# Altium project Service_eval_board.PrjPcb (part 1 of 3)
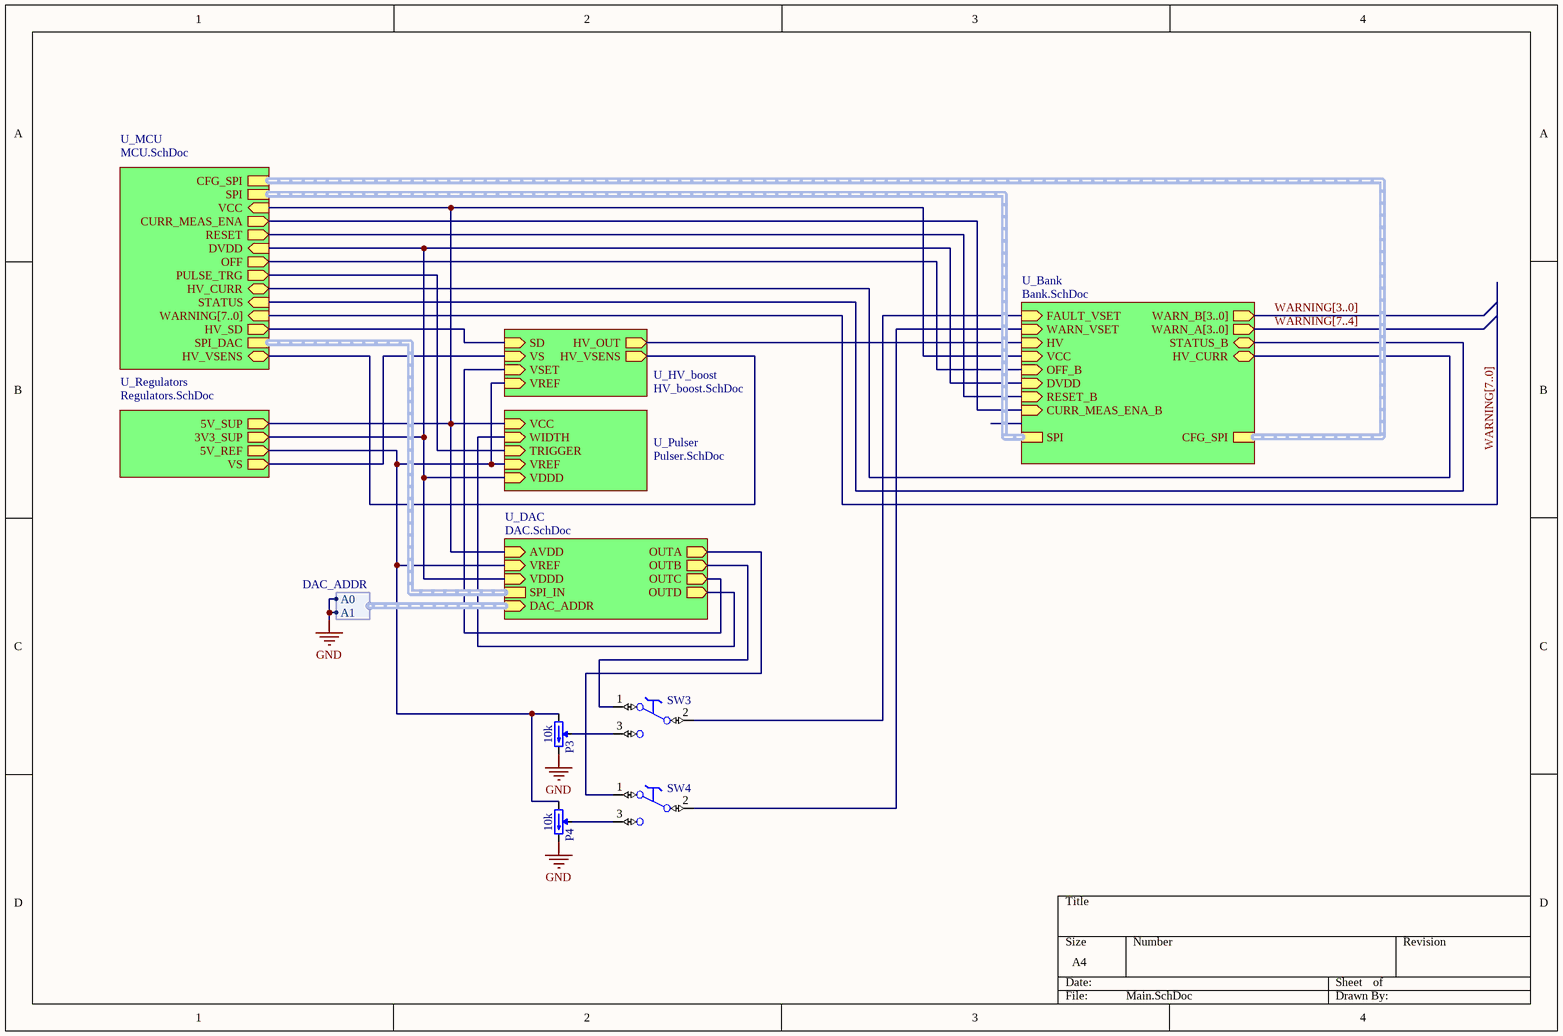
[diagram p0: Main.SchDoc]
10 sheets, 592 parts. Net scope: hierarchical (ports join the sheet entries above them; power ports are global).
Board file: PCB.PcbDoc
Sheets:
  Main.SchDoc
    U_Pulser = Pulser.SchDoc
    U_HV_boost = HV_boost.SchDoc
    U_MCU = MCU.SchDoc
    U_Bank = Bank.SchDoc
      U_Channel = Channel.SchDoc
        U_Switch = Switch.SchDoc
        U_Switch = Switch.SchDoc
        U_TRD = TRD.SchDoc
        U_TRD = TRD.SchDoc
      U_Channel = Channel.SchDoc
        U_Switch = Switch.SchDoc
        U_Switch = Switch.SchDoc
        U_TRD = TRD.SchDoc
        U_TRD = TRD.SchDoc
      U_Channel = Channel.SchDoc
        U_Switch = Switch.SchDoc
        U_Switch = Switch.SchDoc
        U_TRD = TRD.SchDoc
        U_TRD = TRD.SchDoc
      U_Channel = Channel.SchDoc
        U_Switch = Switch.SchDoc
        U_Switch = Switch.SchDoc
        U_TRD = TRD.SchDoc
        U_TRD = TRD.SchDoc
    U_DAC = DAC.SchDoc
    U_Regulators = Regulators.SchDoc

## Sheet Main.SchDoc
size A4; DocumentNumber: 1; SheetNumber: 1; SheetTotal: 10

### Parts
P3  10k  [TRIM_BOURNS_3266W]
P4  10k  [TRIM_BOURNS_3266W]
SW3  Switch  [SW_TYCO_1-1437575-4]  (value not drawn)
SW4  Switch  [SW_TYCO_1-1437575-4]  (value not drawn)

### Sub-sheets
U_Bank = Bank.SchDoc: FAULT_VSET (in), WARN_VSET (in), HV (in), VCC (in), OFF_B (in), DVDD (in), RESET_B (in), CURR_MEAS_ENA_B (in), SPI (harness SPI), CFG_SPI (harness CFG_SPI), WARN_B[3..0] (out), WARN_A[3..0] (out), STATUS_B (bidir), HV_CURR (bidir)
U_DAC = DAC.SchDoc: AVDD (in), VREF (in), VDDD (in), SPI_IN (harness SPI_DAC), DAC_ADDR (in, harness DAC_ADDR), OUTA (out), OUTB (out), OUTC (out), OUTD (out)
U_HV_boost = HV_boost.SchDoc: VS (in), HV_OUT (out), SD (in), VSET (in), VREF (in), HV_VSENS (out)
U_MCU = MCU.SchDoc: STATUS (in), OFF (out), RESET (out), CURR_MEAS_ENA (out), SPI (harness SPI), CFG_SPI (harness CFG_SPI), WARNING[7..0] (in), DVDD (in), VCC (in), HV_CURR (bidir), PULSE_TRG (out), HV_SD (out), SPI_DAC (harness SPI_DAC), HV_VSENS (bidir)
U_Pulser = Pulser.SchDoc: VCC (in), WIDTH (in), TRIGGER (in), VREF (in), VDDD (in)
U_Regulators = Regulators.SchDoc: 5V_SUP (out), 3V3_SUP (out), 5V_REF (out), VS (out)

### Harnesses
DAC_ADDR: A0, A1

### Nets
DVDD: sheet U_Pulser/VDDD, sheet U_MCU/DVDD, sheet U_Bank/DVDD, sheet U_DAC/VDDD, sheet U_Regulators/3V3_SUP
GND: P3.3(CW) P4.3(CW) ; sheet U_DAC/DAC_ADDR.A0, sheet U_DAC/DAC_ADDR.A1
OUTA: SW4.1(NC) ; sheet U_DAC/OUTA
OUTB: SW3.1(NC) ; sheet U_DAC/OUTB
OUTC: sheet U_HV_boost/VSET, sheet U_DAC/OUTC
OUTD: sheet U_Pulser/WIDTH, sheet U_DAC/OUTD
NetC2_1: sheet U_HV_boost/VS, sheet U_Regulators/VS
NetC15_2: sheet U_HV_boost/HV_OUT, sheet U_Bank/HV
NetC45_1_1: sheet U_Pulser/VCC, sheet U_MCU/VCC, sheet U_Bank/VCC, sheet U_DAC/AVDD, sheet U_Regulators/5V_SUP
NetD12_1: sheet U_HV_boost/HV_VSENS, sheet U_MCU/HV_VSENS
NetIC2_1_2: sheet U_MCU/OFF, sheet U_Bank/OFF_B
NetIC2_1_4: sheet U_MCU/RESET, sheet U_Bank/RESET_B
NetIC2_1_6: sheet U_MCU/CURR_MEAS_ENA, sheet U_Bank/CURR_MEAS_ENA_B
NetIC6_23: sheet U_MCU/HV_CURR, sheet U_Bank/HV_CURR
NetIC6_56: sheet U_MCU/STATUS, sheet U_Bank/STATUS_B
NetIC6_61: sheet U_HV_boost/SD, sheet U_MCU/HV_SD
NetIC6_62: sheet U_Pulser/TRIGGER, sheet U_MCU/PULSE_TRG
NetL7_2: P3.1(CCW) P4.1(CCW) ; sheet U_Pulser/VREF, sheet U_HV_boost/VREF, sheet U_DAC/VREF, sheet U_Regulators/5V_REF
NetP3_2: P3.2(W) SW3.3(NO)
NetP4_2: P4.2(W) SW4.3(NO)
NetR40_1_1: SW3.2(C) ; sheet U_Bank/FAULT_VSET
NetR41_1_1: SW4.2(C) ; sheet U_Bank/WARN_VSET

### Buses and harness runs
bus WARNING[3..0] = sheet U_Bank/WARN_B[3..0]
bus WARNING[7..0] = sheet U_MCU/WARNING[7..0]
bus WARNING[7..4] = sheet U_Bank/WARN_A[3..0]
harness sheet U_Bank/CFG_SPI = sheet U_MCU/CFG_SPI
harness sheet U_Bank/SPI = sheet U_MCU/SPI
harness sheet U_DAC/SPI_IN = sheet U_MCU/SPI_DAC

### Library data of the parts
P3 P4 = TRIM_12T_10K_BOURNS_3266W-1-103LF: Trimming Potentiometer; Part Description: 12 Turn Trimming Potentiometer (Top Adjustement); Manufacturer: BOURNS; Power: 0.25W; TC: ±100ppm/°C; Tolerance: ±10%; PressFit: No; Part Number: TRIM_12T_10K_BOURNS_3266W-1-103LF; Component Kind: Standard; Component Type: Standard; Pin Count: 3; Value: 10k; Manufacturer Part Number: 3266W-1-103LF; Case: 3266W; Mounted: Yes; Socket: No; SMD: No; Sense: No; ComponentHeight: 7.75mm; HelpURL: \\cern.ch\dfs\Applications\Altium\Datasheets\TRIM_BOURNS_3266W.pdf; Author: CERN DEM JLC; CreateDate: 10.06.2008; LatestRevisionDate: 28.11.2012
SW3 SW4 = SW_TYCO_1-1437575-4: SPDT Switch; Part Description: 30VDC, 100mA, Slide Low Profile SPDT Switch, SSA Series; Manufacturer: TYCO; Manufacturer Part Number: 1-1437575-4 or SSA-12; PressFit: No; Part Number: SW_TYCO_1-1437575-4; Component Kind: Standard; Component Type: Standard; Pin Count: 3; PackageDescription: Body 8.79 x 3.4mm, Slide Low Profile SPDT Switch, SSA Series; Family: Switch; Mounted: Yes; Socket: No; SMD: No; Sense: No; Status: None; ComponentHeight: 5.4mm; HelpURL: \\cern.ch\dfs\Applications\Altium\Datasheets\SW_TYCO_1-1437575-4.pdf; Author: CERN DEM JLC; CreateDate: 11.11.2013; LatestRevisionDate: 11.11.2013

## Sheet Pulser.SchDoc
size A3; DocumentNumber: 6; SheetNumber: 6; SheetTotal: 10
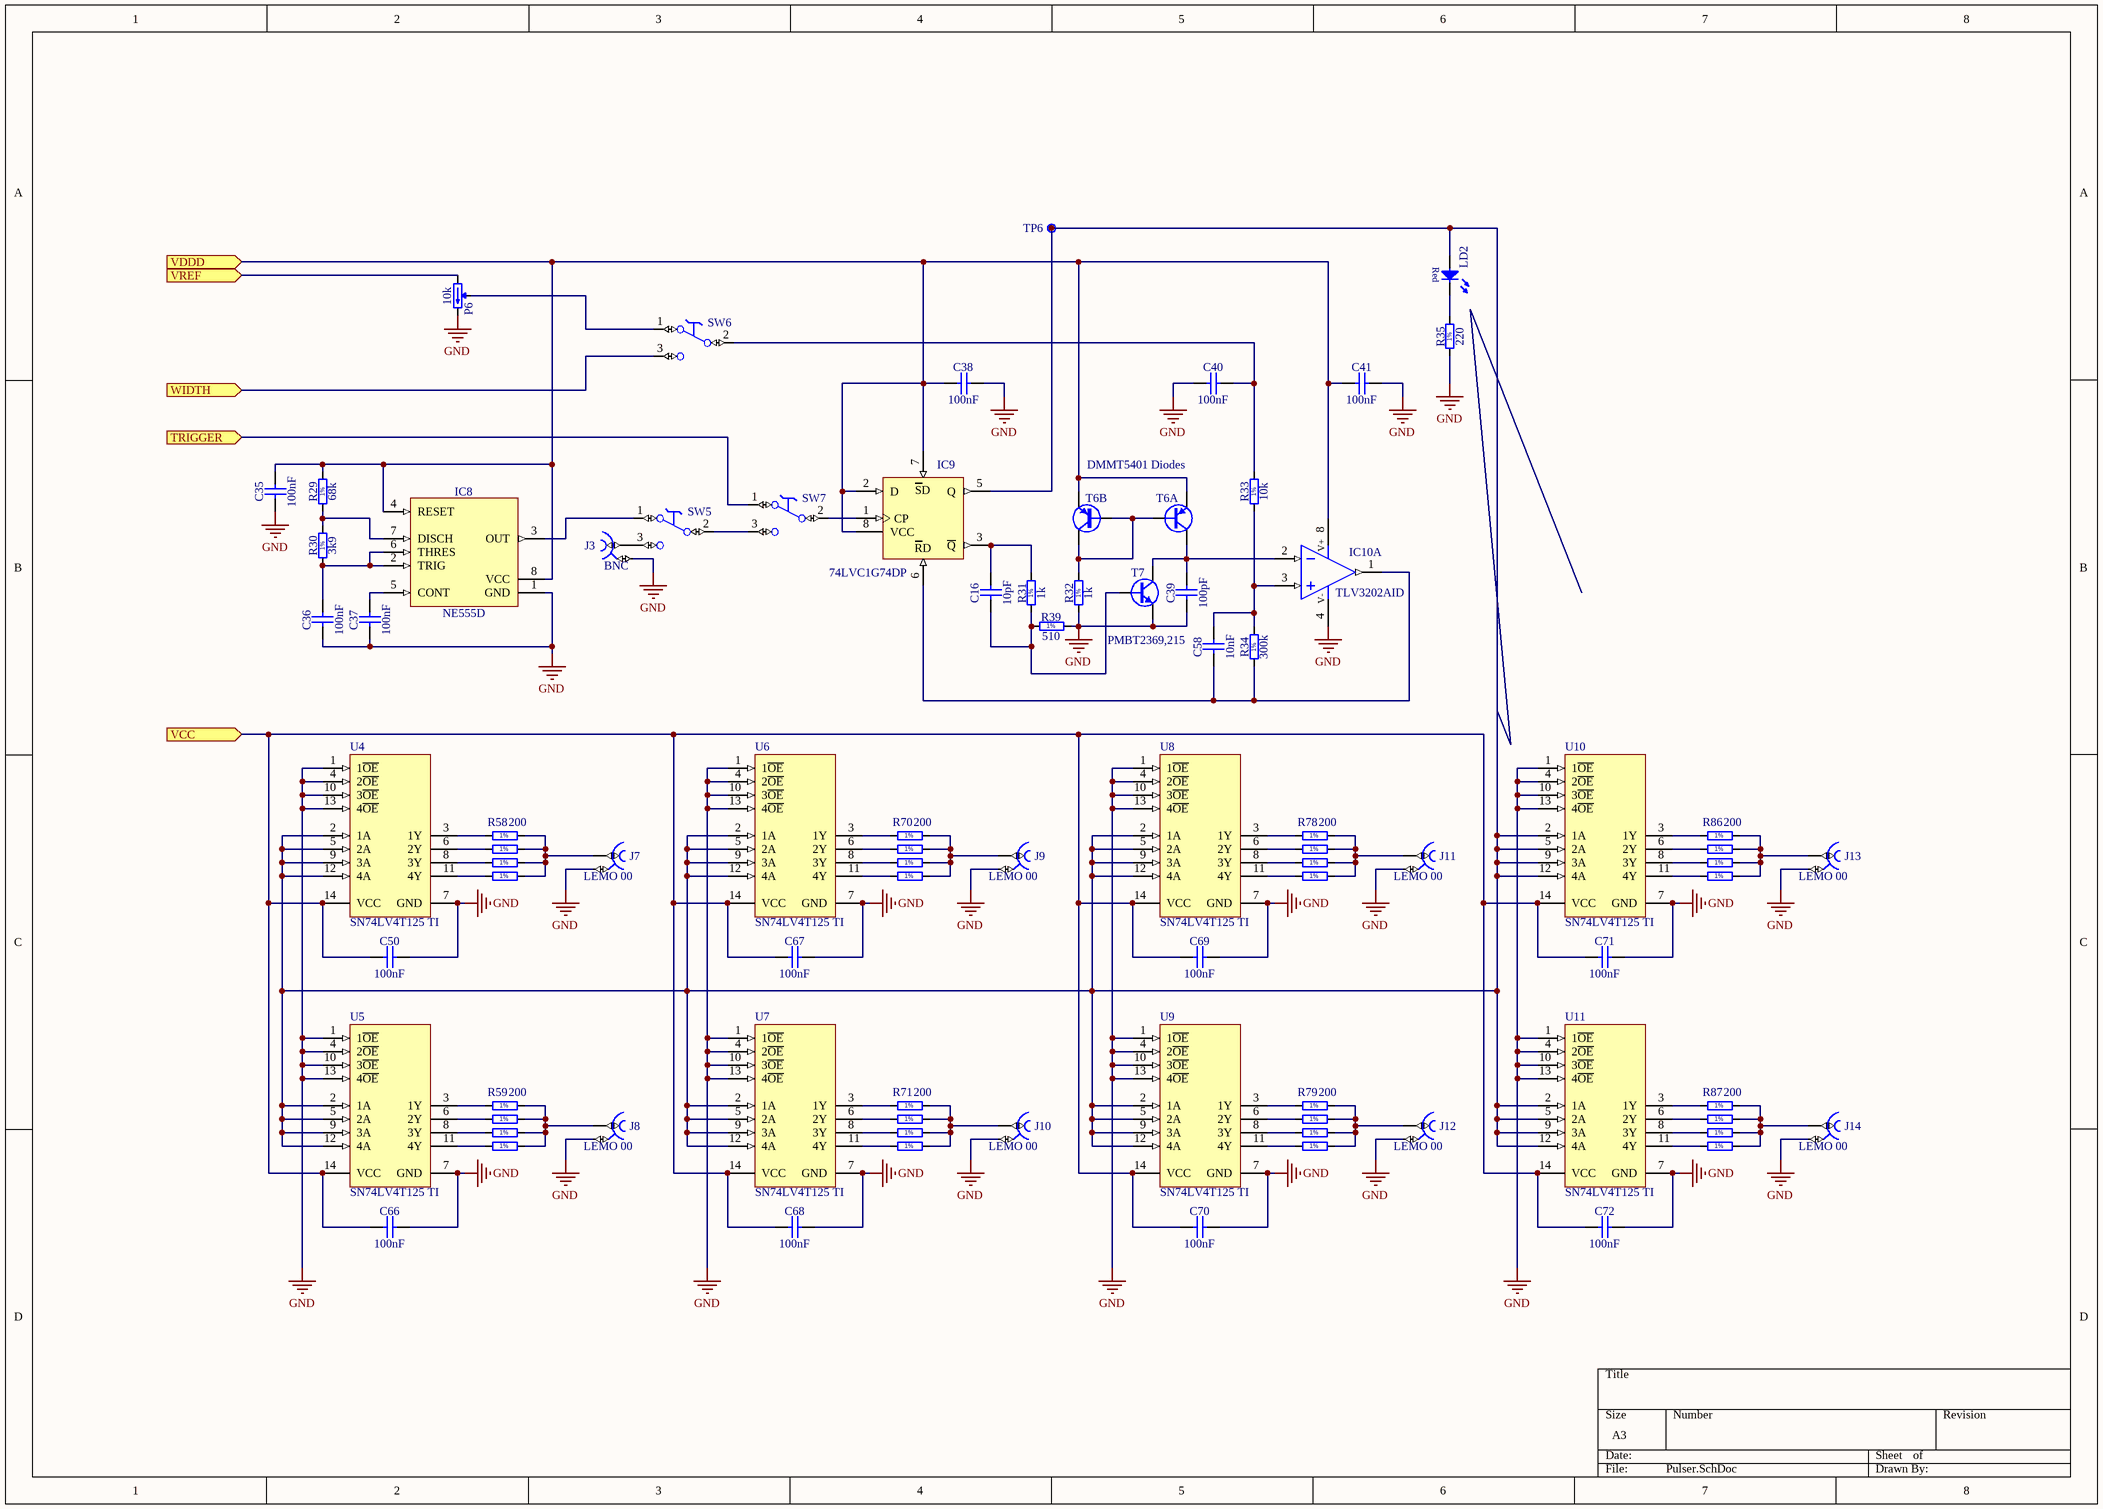
[diagram p1: Pulser.SchDoc]

### Parts
C16  10pF  [CAPC2012X135N]
C35  100nF  [CAPC2012X135N]
C36  100nF  [CAPC2012X135N]
C37  100nF  [CAPC2012X135N]
C38  100nF  [CAPC2012X135N]
C39  100pF  [CAPC2012X88N]
C40  100nF  [CAPC2012X135N]
C41  100nF  [CAPC2012X135N]
C50  100nF  [CAPC2012X135N]
C58  10nF  [CAPC2012X135N]
C66  100nF  [CAPC2012X135N]
C67  100nF  [CAPC2012X135N]
C68  100nF  [CAPC2012X135N]
C69  100nF  [CAPC2012X135N]
C70  100nF  [CAPC2012X135N]
C71  100nF  [CAPC2012X135N]
C72  100nF  [CAPC2012X135N]
IC8  NE555D  [SOIC127P600X175-8N]
IC9  74LVC1G74DP  [SOP65P400X110-8N]
IC10  TLV3202AID  [SOIC127P600X175-8N]  (part A of 2)
J3  BNC  [AMPHENOL_31-5329]
J7  LEMO 00  [LEMO_EPK.00.250.NTN]
J8  LEMO 00  [LEMO_EPK.00.250.NTN]
J9  LEMO 00  [LEMO_EPK.00.250.NTN]
J10  LEMO 00  [LEMO_EPK.00.250.NTN]
J11  LEMO 00  [LEMO_EPK.00.250.NTN]
J12  LEMO 00  [LEMO_EPK.00.250.NTN]
J13  LEMO 00  [LEMO_EPK.00.250.NTN]
J14  LEMO 00  [LEMO_EPK.00.250.NTN]
LD2  Super Red  [LED_OSRAM_LSR976]  (value not drawn)
P6  10k  [TRIM_BOURNS_3266W]
R29  68k  [RESC2012X60N]
R30  3k9  [RESC2012X60N]
R31  1k  [RESC2012X60N]
R32  1k  [RESC2012X60N]
R33  10k  [RESC2012X60N]
R34  300k  [RESC2012X60N]
R35  220  [RESC2012X60N]
R39  510  [RESC2012X60N]
R58  200  [RESC2012X60N]
R59  200  [RESC2012X60N]
R60  200  [RESC2012X60N]  (value not drawn)
R61  200  [RESC2012X60N]  (value not drawn)
R62  200  [RESC2012X60N]  (value not drawn)
R63  200  [RESC2012X60N]  (value not drawn)
R64  200  [RESC2012X60N]  (value not drawn)
R65  200  [RESC2012X60N]  (value not drawn)
R70  200  [RESC2012X60N]
R71  200  [RESC2012X60N]
R72  200  [RESC2012X60N]  (value not drawn)
R73  200  [RESC2012X60N]  (value not drawn)
R74  200  [RESC2012X60N]  (value not drawn)
R75  200  [RESC2012X60N]  (value not drawn)
R76  200  [RESC2012X60N]  (value not drawn)
R77  200  [RESC2012X60N]  (value not drawn)
R78  200  [RESC2012X60N]
R79  200  [RESC2012X60N]
R80  200  [RESC2012X60N]  (value not drawn)
R81  200  [RESC2012X60N]  (value not drawn)
R82  200  [RESC2012X60N]  (value not drawn)
R83  200  [RESC2012X60N]  (value not drawn)
R84  200  [RESC2012X60N]  (value not drawn)
R85  200  [RESC2012X60N]  (value not drawn)
R86  200  [RESC2012X60N]
R87  200  [RESC2012X60N]
R88  200  [RESC2012X60N]  (value not drawn)
R89  200  [RESC2012X60N]  (value not drawn)
R90  200  [RESC2012X60N]  (value not drawn)
R91  200  [RESC2012X60N]  (value not drawn)
R92  200  [RESC2012X60N]  (value not drawn)
R93  200  [RESC2012X60N]  (value not drawn)
SW5  Switch  [SW_TYCO_1-1437575-4]  (value not drawn)
SW6  Switch  [SW_TYCO_1-1437575-4]  (value not drawn)
SW7  Switch  [SW_TYCO_1-1437575-4]  (value not drawn)
T6  DMMT5401 Diodes  [SOT95P280X145-6N]  (parts A,B of 2)
T7  PMBT2369,215  [SOT95P230X110-3N]
TP6  Test Point  [VERO_20-2136]  (value not drawn)
U4  SN74LV4T125 TI  [SOP65P640X110-14N]
U5  SN74LV4T125 TI  [SOP65P640X110-14N]
U6  SN74LV4T125 TI  [SOP65P640X110-14N]
U7  SN74LV4T125 TI  [SOP65P640X110-14N]
U8  SN74LV4T125 TI  [SOP65P640X110-14N]
U9  SN74LV4T125 TI  [SOP65P640X110-14N]
U10  SN74LV4T125 TI  [SOP65P640X110-14N]
U11  SN74LV4T125 TI  [SOP65P640X110-14N]

### Ports
TRIGGER (in), VCC (in), VDDD (in), VREF (in), WIDTH (in)

### Nets
DVDD: C35.2 C38.1 C41.1 IC8.4(RESET) IC8.8(VCC) IC9.2(D) IC9.7(~{S}D) IC9.8(VCC) IC10.8(V+) R29.2 T6.5(E) T6.6(E) ; port VDDD
GND: C35.1 C36.1 C37.1 C38.2 C39.1 C40.1 C41.2 C50.2 C66.2 C67.2 C68.2 C69.2 C70.2 C71.2 C72.2 IC8.1(GND) IC10.4(V-) J3.2 J7.2 J8.2 J9.2 J10.2 J11.2 J12.2 J13.2 J14.2 P6.3(CW) R32.1 R35.1 R39.2 T7.2(E) U4.1(1~{OE}) U4.4(2~{OE}) U4.7(GND) U4.10(3~{OE}) U4.13(4~{OE}) U5.1(1~{OE}) U5.4(2~{OE}) U5.7(GND) U5.10(3~{OE}) U5.13(4~{OE}) U6.1(1~{OE}) U6.4(2~{OE}) U6.7(GND) U6.10(3~{OE}) U6.13(4~{OE}) U7.1(1~{OE}) U7.4(2~{OE}) U7.7(GND) U7.10(3~{OE}) U7.13(4~{OE}) U8.1(1~{OE}) U8.4(2~{OE}) U8.7(GND) U8.10(3~{OE}) U8.13(4~{OE}) U9.1(1~{OE}) U9.4(2~{OE}) U9.7(GND) U9.10(3~{OE}) U9.13(4~{OE}) U10.1(1~{OE}) U10.4(2~{OE}) U10.7(GND) U10.10(3~{OE}) U10.13(4~{OE}) U11.1(1~{OE}) U11.4(2~{OE}) U11.7(GND) U11.10(3~{OE}) U11.13(4~{OE})
OUTD: SW6.3(NO) ; port WIDTH
NetC16_1: C16.1 R31.1 R39.1 T7.1(B)
NetC16_2: C16.2 IC9.3(~{Q}) R31.2
NetC36_2: C36.2 IC8.2(TRIG) IC8.6(THRES) R30.1
NetC37_2: C37.2 IC8.5(CONT)
NetC39_2: C39.2 IC10.2(IN-) T6.1(C) T7.3(C)
NetC40_2: C40.2 R33.2 SW6.2(C)
NetC45_1_1: C50.1 C66.1 C67.1 C68.1 C69.1 C70.1 C71.1 C72.1 U4.14(VCC) U5.14(VCC) U6.14(VCC) U7.14(VCC) U8.14(VCC) U9.14(VCC) U10.14(VCC) U11.14(VCC) ; port VCC
NetC58_1: C58.1 IC9.6(~{RD}) IC10.1(OUT) R34.1
NetC58_2: C58.2 IC10.3(IN+) R33.1 R34.2
NetIC6_62: SW7.1(NC) ; port TRIGGER
NetIC8_3: IC8.3(OUT) SW5.1(NC)
NetIC8_7: IC8.7(DISCH) R29.1 R30.2
NetIC9_1: IC9.1(CP) SW7.2(C)
NetIC9_5: IC9.5(Q) LD2.2(A) TP6.1 U4.2(1A) U4.5(2A) U4.9(3A) U4.12(4A) U5.2(1A) U5.5(2A) U5.9(3A) U5.12(4A) U6.2(1A) U6.5(2A) U6.9(3A) U6.12(4A) U7.2(1A) U7.5(2A) U7.9(3A) U7.12(4A) U8.2(1A) U8.5(2A) U8.9(3A) U8.12(4A) U9.2(1A) U9.5(2A) U9.9(3A) U9.12(4A) U10.2(1A) U10.5(2A) U10.9(3A) U10.12(4A) U11.2(1A) U11.5(2A) U11.9(3A) U11.12(4A)
NetJ3_1: J3.1 SW5.3(NO)
NetJ7_1: J7.1 R58.2 R60.2 R61.2 R62.2
NetJ8_1: J8.1 R59.2 R63.2 R64.2 R65.2
NetJ9_1: J9.1 R70.2 R72.2 R73.2 R74.2
NetJ10_1: J10.1 R71.2 R75.2 R76.2 R77.2
NetJ11_1: J11.1 R78.2 R80.2 R81.2 R82.2
NetJ12_1: J12.1 R79.2 R83.2 R84.2 R85.2
NetJ13_1: J13.1 R86.2 R88.2 R89.2 R90.2
NetJ14_1: J14.1 R87.2 R91.2 R92.2 R93.2
NetL7_2: P6.1(CCW) ; port VREF
NetLD2_1: LD2.1(C) R35.2
NetP6_2: P6.2(W) SW6.1(NC)
NetR32_2: R32.2 T6.2(B) T6.3(B) T6.4(C)
NetR58_1: R58.1 U4.3(1Y)
NetR59_1: R59.1 U5.3(1Y)
NetR60_1: R60.1 U4.6(2Y)
NetR61_1: R61.1 U4.8(3Y)
NetR62_1: R62.1 U4.11(4Y)
NetR63_1: R63.1 U5.6(2Y)
NetR64_1: R64.1 U5.8(3Y)
NetR65_1: R65.1 U5.11(4Y)
NetR70_1: R70.1 U6.3(1Y)
NetR71_1: R71.1 U7.3(1Y)
NetR72_1: R72.1 U6.6(2Y)
NetR73_1: R73.1 U6.8(3Y)
NetR74_1: R74.1 U6.11(4Y)
NetR75_1: R75.1 U7.6(2Y)
NetR76_1: R76.1 U7.8(3Y)
NetR77_1: R77.1 U7.11(4Y)
NetR78_1: R78.1 U8.3(1Y)
NetR79_1: R79.1 U9.3(1Y)
NetR80_1: R80.1 U8.6(2Y)
NetR81_1: R81.1 U8.8(3Y)
NetR82_1: R82.1 U8.11(4Y)
NetR83_1: R83.1 U9.6(2Y)
NetR84_1: R84.1 U9.8(3Y)
NetR85_1: R85.1 U9.11(4Y)
NetR86_1: R86.1 U10.3(1Y)
NetR87_1: R87.1 U11.3(1Y)
NetR88_1: R88.1 U10.6(2Y)
NetR89_1: R89.1 U10.8(3Y)
NetR90_1: R90.1 U10.11(4Y)
NetR91_1: R91.1 U11.6(2Y)
NetR92_1: R92.1 U11.8(3Y)
NetR93_1: R93.1 U11.11(4Y)
NetSW5_2: SW5.2(C) SW7.3(NO)

Not connected (* = marked no-connect by the designer): IC9 4(GND)

### Notes on the sheet
- (in symbol 74LVC1G74DP) SD; RD
- (in symbol LED_OSRAM_LSR976) Red
- (in symbol R0805_1K_1%_0.33W_100PPM_VISHAY_CRCW-HP) 1%
- (in symbol R0805_3K9_1%_0.125W_100PPM) 1%
- (in symbol R0805_10K_1%_0.125W_100PPM) 1%
- (in symbol R0805_68K_1%_0.125W_100PPM) 1%
- (in symbol R0805_200R_1%_0.125W_100PPM) 1%
- (in symbol R0805_220R_1%_0.125W_100PPM) 1%
- (in symbol R0805_300K_1%_0.125W_100PPM) 1%
- (in symbol R0805_510R_1%_0.125W_100PPM) 1%

### Library data of the parts
C16 = CC0805_10PF_50V_1%_NP0: Non-polarised capacitor; Part Description: SMD Multilayer Chip Ceramic Capacitor; Manufacturer: GENERIC; Manufacturer1 Part Number: 223886118109; Voltage: 50V; TC: C0G/NP0; Tolerance: ±1%; Part Number: CC0805_10PF_50V_1%_NP0; Component Kind: Standard; Component Type: Standard; Pin Count: 2; Value: 10pF; Status: None; Manufacturer Part Number: CC0805_10PF_50V_1%_NP0; Case: 0805; Mounted: Yes; Socket: No; SMD: Yes; Sense: No; Manufacturer1 Example: PHYCOMP; Manufacturer1 ComponentHeight: 1.35mm; HelpURL: \\cern.ch\dfs\Applications\Altium\Datasheets\CC0805_NP0_PHYCOMP.pdf; Author: CERN DEM MR; CreateDate: 31.05.2016; LatestRevisionDate: 31.05.2016
C35-C38 C40 C41 C50 C66-C72 = CC0805_100NF_50V_10%_X7R: Non-polarised capacitor; Part Description: SMD Multilayer Chip Ceramic Capacitor; Manufacturer: GENERIC; Manufacturer1 Part Number: C2012X7R1H104K085AA; Voltage: 50V; TC: X7R; Tolerance: ±10%; Part Number: CC0805_100NF_50V_10%_X7R; Component Kind: Standard; Component Type: Standard; Pin Count: 2; Value: 100nF; Status: Preferred; Manufacturer Part Number: CC0805_100NF_50V_10%_X7R; Case: 0805; Mounted: Yes; Socket: No; SMD: Yes; Sense: No; Manufacturer1 Example: TDK; Manufacturer1 ComponentHeight: 1mm; HelpURL: \\cern.ch\dfs\Applications\Altium\Datasheets\CC0805_X7R_TDK_C.pdf; Author: CERN DEM JLC; CreateDate: 03.12.2007; LatestRevisionDate: 22.04.2015
C39 = CC0805_100PF_50V_5%_C0G_KEMET_C0805C101J5GACAUTO: Non-polarised capacitor; Part Description: SMD Multilayer Chip Ceramic Capacitor (Automotive Grade); Manufacturer: KEMET; Voltage: 50V; TC: C0G/NP0; Tolerance: ±5%; Part Number: CC0805_100PF_50V_5%_C0G_KEMET_C0805C101J5GACAUTO; Component Kind: Standard; Component Type: Standard; Pin Count: 2; Value: 100pF; Status: Not Recommended; Manufacturer Part Number: C0805C101J5GACAUTO; Case: 0805; Mounted: Yes; Socket: No; SMD: Yes; Sense: No; ComponentHeight: 0.88mm; HelpURL: \\cern.ch\dfs\Applications\Altium\Datasheets\CC0805_KEMET_C0805C101J5GACAUTO.pdf; Author: CERN DEM BC; CreateDate: 26.02.2016; LatestRevisionDate: 26.02.2016
C58 = CC0805_10NF_50V_5%_X7R: Non-polarised capacitor; Part Description: SMD Multilayer Chip Ceramic Capacitor; Manufacturer: GENERIC; Manufacturer1 Part Number: 08055C103JAT2A; Voltage: 50V; TC: X7R; Tolerance: ±5%; Part Number: CC0805_10NF_50V_5%_X7R; Component Kind: Standard; Component Type: Standard; Pin Count: 2; Value: 10nF; Status: None; Manufacturer Part Number: CC0805_10NF_50V_5%_X7R; Case: 0805; Mounted: Yes; Socket: No; SMD: Yes; Sense: No; Manufacturer1 Example: AVX; Manufacturer1 ComponentHeight: 0.94mm; HelpURL: \\cern.ch\dfs\Applications\Altium\Datasheets\CC0805_X7R_AVX.pdf; Author: CERN DEM JLC; CreateDate: 18.01.2011; LatestRevisionDate: 18.01.2011
IC8 = NE555D: Precision Timer; Manufacturer: TEXAS INSTRUMENTS; PressFit: No; Bonding: No; Part Number: NE555D; Component Kind: Standard; Component Type: Standard; Device: NE555D; PackageDescription: SOIC 8, Pitch 1.27mm, Body 4x5mm, IPC Medium Density; Part Description: Precision Timer; Manufacturer Part Number: NE555D; Pin Count: 8; Case: SOIC8; Mounted: Yes; Socket: No; SMD: Yes; Sense: No; ComponentHeight: 1.75mm; Author: CERN DEM JMW; HelpURL: \\cern.ch\dfs\Applications\Altium\Datasheets\NE555D.pdf; CreateDate: 16.04.2009; LatestRevisionDate: 16.04.2009
IC9 = 74LVC1G74DP: Single D-type flip-flop with set and reset, positive edge trigger; Manufacturer: NXP SEMICONDUCTORS; PressFit: No; Bonding: No; Part Number: 74LVC1G74DP; Component Kind: Standard; Component Type: Standard; Device: 74LVC1G74DP; PackageDescription: SOP, 0.65mm, pitch; 8 pin, 3.00mm W X 3.00mm L X 1.10mm H body, PC Medium Density; Part Description: Single D-Type Flip-Flop With Set And Reset, Positive Edge Trigger; Manufacturer Part Number: 74LVC1G74DP; Pin Count: 8; Case: TSSOP8; Mounted: Yes; Socket: No; SMD: Yes; Sense: No; ComponentHeight: 1.1mm; Author: CERN DEM JLC; HelpURL: \\cern.ch\dfs\Applications\Altium\Datasheets\74LVC1G74DP.pdf; CreateDate: 26.04.2010; LatestRevisionDate: 26.04.2010
IC10 = TLV3202AID: Dual Operational Amplifier; Part Description: Dual 40-ns, microPOWER, Push-Pull Output Comparator; Manufacturer: TEXAS INSTRUMENTS; PressFit: No; Bonding: No; Part Number: TLV3202AID; Component Kind: Standard; Component Type: Standard; Device: TLV3202AID; PackageDescription: SOIC 8, Pitch 1.27mm - Body 4x5mm, IPC Medium Density; Manufacturer Part Number: TLV3202AID; Pin Count: 8; Case: SOIC8; Mounted: Yes; Socket: No; SMD: Yes; Sense: No; ComponentHeight: 1.75mm; Author: CERN DEM JLC; HelpURL: \\cern.ch\dfs\Applications\Altium\Datasheets\TLV3202AID.pdf; CreateDate: 11.02.2015; LatestRevisionDate: 11.02.2015
J3 = AMPHENOL_31-5329: Part Description: 50 Ohms BNC PCB Receptacle (Jack), Post Terminal, 3 Legs; Manufacturer: AMPHENOL-RF; PressFit: No; Part Number: AMPHENOL_31-5329; Component Kind: Standard; Component Type: Standard; Pin Count: 2; Family: BNC; Mounted: Yes; Socket: No; SMD: No; Sense: No; Status: None; Manufacturer Part Number: 31-5329; ComponentHeight: 17.6mm; HelpURL: \\cern.ch\dfs\Applications\Altium\Datasheets\AMPHENOL_31-5329.pdf; Author: CERN DEM JLC; CreateDate: 03.06.2009; LatestRevisionDate: 14.07.2011
J7-J14 = LEMO_EPK.00.250.NTN: Part Description: Size 00, 50 Ohms Coaxial Elbow (90°) socket With Clearance Under The Body; PressFit: No; SCEM: 09.46.11.180.6; Part Number: LEMO_EPK.00.250.NTN; Component Kind: Standard; Component Type: Standard; Pin Count: 2; Family: LEMO 00; Mounted: Yes; Socket: No; SMD: No; Sense: No; Status: None; Manufacturer: LEMO; Manufacturer Part Number: EPK.00.250.NTN; ComponentHeight: 7mm; HelpURL: \\cern.ch\dfs\Applications\Altium\Datasheets\LEMO_EPK.00.250.NTN.pdf; Author: CERN DEM JLC; CreateDate: 04.09.2012; LatestRevisionDate: 04.09.2012
LD2 = LED_OSRAM_LSR976: LED Red 1C 2A; Part Description: Surface Mount Super Red LED (0805 Case); Manufacturer: OSRAM; Manufacturer Part Number: LSR976; PressFit: No; Bonding: No; Part Number: LED_OSRAM_LSR976; Component Kind: Standard; Component Type: Standard; Color: Super Red; PackageDescription: Super Red Chip LED, 2-Leads, Body 2 x1.25mm, IPC Medium Density; Pin Count: 2; Case: 0805; Mounted: Yes; Socket: No; SMD: Yes; Sense: No; ComponentHeight: 0.9mm; HelpURL: \\cern.ch\dfs\Applications\Altium\Datasheets\LED_OSRAM_LSR976.pdf; Author: CERN DEM JLC; CreateDate: 18.05.2010; LatestRevisionDate: 18.05.2010
P6 = TRIM_12T_10K_BOURNS_3266W-1-103LF: as P3 on sheet Main; Part Number: TRIM_12T_10K_BOURNS_3266W-1-103LF; Component Kind: Standard; Component Type: Standard; Pin Count: 3; Value: 10k; Manufacturer Part Number: 3266W-1-103LF; Case: 3266W; Mounted: Yes; Socket: No; SMD: No; Sense: No; ComponentHeight: 7.75mm; HelpURL: \\cern.ch\dfs\Applications\Altium\Datasheets\TRIM_BOURNS_3266W.pdf; Author: CERN DEM JLC; CreateDate: 10.06.2008; LatestRevisionDate: 28.11.2012
R29 = R0805_68K_1%_0.125W_100PPM: Resistor - 1%; Part Description: General Purpose Thick Film Chip Resistor; Manufacturer: GENERIC; Manufacturer1 Part Number: NRC10F6802TRF; Power: 0.125W; TC: ±100ppm/°C; PressFit: No; Part Number: R0805_68K_1%_0.125W_100PPM; Component Kind: Standard; Component Type: Standard; Pin Count: 2; Value: 68k; Status: Preferred; Tolerance: ±1%; Manufacturer Part Number: R0805_68K_1%_0.125W_100PPM; Case: 0805; Mounted: Yes; Sense: No; Socket: No; SMD: Yes; Manufacturer1 Example: NIC COMPONENT; Manufacturer1 ComponentHeight: 0.6mm; HelpURL: \\cern.ch\dfs\Applications\Altium\Datasheets\R0805_NIC_NRC.pdf; Author: CERN DEM JLC; CreateDate: 03.12.2007; LatestRevisionDate: 13.03.2008
R30 = R0805_3K9_1%_0.125W_100PPM: Resistor - 1%; Part Description: General Purpose Thick Film Chip Resistor; Manufacturer: GENERIC; Manufacturer1 Part Number: NRC10F3901TRF; Power: 0.125W; TC: ±100ppm/°C; PressFit: No; Part Number: R0805_3K9_1%_0.125W_100PPM; Component Kind: Standard; Component Type: Standard; Pin Count: 2; Value: 3k9; Status: Preferred; Tolerance: ±1%; Manufacturer Part Number: R0805_3K9_1%_0.125W_100PPM; Case: 0805; Mounted: Yes; Sense: No; Socket: No; SMD: Yes; Manufacturer1 Example: NIC COMPONENT; Manufacturer1 ComponentHeight: 0.6mm; HelpURL: \\cern.ch\dfs\Applications\Altium\Datasheets\R0805_NIC_NRC.pdf; Author: CERN DEM JLC; CreateDate: 03.12.2007; LatestRevisionDate: 13.03.2008
R31 R32 = R0805_1K_1%_0.33W_100PPM_VISHAY_CRCW-HP: Resistor - 1%; Part Description: 150V, Pulse Proof, High Power Thick Film Chip Resistor; Manufacturer: VISHAY DRALORIC; Manufacturer Part Number: CRCW08051K00FKEAHP; Power: 0.33W; TC: ±100ppm/°C; PressFit: No; Part Number: R0805_1K_1%_0.33W_100PPM_VISHAY_CRCW-HP; Component Kind: Standard; Component Type: Standard; Pin Count: 2; Value: 1k; Status: None; Tolerance: ±1%; Case: 0805; Mounted: Yes; Sense: No; Socket: No; SMD: Yes; Manufacturer1 ComponentHeight: 0.6mm; HelpURL: \\cern.ch\dfs\Applications\Altium\Datasheets\R0805_VISHAY_CRCW-HP e3.pdf; Author: CERN DEM JLC; CreateDate: 16.06.2010; LatestRevisionDate: 16.06.2010
R33 = R0805_10K_1%_0.125W_100PPM: Resistor - 1%; Part Description: General Purpose Thick Film Chip Resistor; Manufacturer: GENERIC; Manufacturer1 Part Number: NRC10F1002TRF; Power: 0.125W; TC: ±100ppm/°C; PressFit: No; Part Number: R0805_10K_1%_0.125W_100PPM; Component Kind: Standard; Component Type: Standard; Pin Count: 2; Value: 10k; Status: Preferred; Tolerance: ±1%; Manufacturer Part Number: R0805_10K_1%_0.125W_100PPM; Case: 0805; Mounted: Yes; Sense: No; Socket: No; SMD: Yes; Manufacturer1 Example: NIC COMPONENT; Manufacturer1 ComponentHeight: 0.6mm; HelpURL: \\cern.ch\dfs\Applications\Altium\Datasheets\R0805_NIC_NRC.pdf; Author: CERN DEM JLC; CreateDate: 03.12.2007; LatestRevisionDate: 13.03.2008
R34 = R0805_300K_1%_0.125W_100PPM: Resistor - 1%; Part Description: General Purpose Thick Film Chip Resistor; Manufacturer: GENERIC; Manufacturer1 Part Number: NRC10F3003TRF; Power: 0.125W; TC: ±100ppm/°C; PressFit: No; Part Number: R0805_300K_1%_0.125W_100PPM; Component Kind: Standard; Component Type: Standard; Pin Count: 2; Value: 300k; Status: Preferred; Tolerance: ±1%; Manufacturer Part Number: R0805_300K_1%_0.125W_100PPM; Case: 0805; Mounted: Yes; Sense: No; Socket: No; SMD: Yes; Manufacturer1 Example: NIC COMPONENT; Manufacturer1 ComponentHeight: 0.6mm; HelpURL: \\cern.ch\dfs\Applications\Altium\Datasheets\R0805_NIC_NRC.pdf; Author: CERN DEM JLC; CreateDate: 03.12.2007; LatestRevisionDate: 13.03.2008
R35 = R0805_220R_1%_0.125W_100PPM: Resistor - 1%; Part Description: General Purpose Thick Film Chip Resistor; Manufacturer: GENERIC; Manufacturer1 Part Number: NRC10F2200TRF; Power: 0.125W; TC: ±100ppm/°C; PressFit: No; Part Number: R0805_220R_1%_0.125W_100PPM; Component Kind: Standard; Component Type: Standard; Pin Count: 2; Value: 220; Status: Preferred; Tolerance: ±1%; Manufacturer Part Number: R0805_220R_1%_0.125W_100PPM; Case: 0805; Mounted: Yes; Sense: No; Socket: No; SMD: Yes; Manufacturer1 Example: NIC COMPONENT; Manufacturer1 ComponentHeight: 0.6mm; HelpURL: \\cern.ch\dfs\Applications\Altium\Datasheets\R0805_NIC_NRC.pdf; Author: CERN DEM JLC; CreateDate: 03.12.2007; LatestRevisionDate: 13.03.2008
R39 = R0805_510R_1%_0.125W_100PPM: Resistor - 1%; Part Description: General Purpose Thick Film Chip Resistor; Manufacturer: GENERIC; Manufacturer1 Part Number: NRC10F5100TRF; Power: 0.125W; TC: ±100ppm/°C; PressFit: No; Part Number: R0805_510R_1%_0.125W_100PPM; Component Kind: Standard; Component Type: Standard; Pin Count: 2; Value: 510; Status: Preferred; Tolerance: ±1%; Manufacturer Part Number: R0805_510R_1%_0.125W_100PPM; Case: 0805; Mounted: Yes; Sense: No; Socket: No; SMD: Yes; Manufacturer1 Example: NIC COMPONENT; Manufacturer1 ComponentHeight: 0.6mm; HelpURL: \\cern.ch\dfs\Applications\Altium\Datasheets\R0805_NIC_NRC.pdf; Author: CERN DEM JLC; CreateDate: 03.12.2007; LatestRevisionDate: 13.03.2008
R58-R65 R70-R93 = R0805_200R_1%_0.125W_100PPM: Resistor - 1%; Part Description: General Purpose Thick Film Chip Resistor; Manufacturer: GENERIC; Manufacturer1 Part Number: NRC10F2000TRF; Power: 0.125W; TC: ±100ppm/°C; PressFit: No; Part Number: R0805_200R_1%_0.125W_100PPM; Component Kind: Standard; Component Type: Standard; Pin Count: 2; Value: 200; Status: Preferred; Tolerance: ±1%; Manufacturer Part Number: R0805_200R_1%_0.125W_100PPM; Case: 0805; Mounted: Yes; Sense: No; Socket: No; SMD: Yes; Manufacturer1 Example: NIC COMPONENT; Manufacturer1 ComponentHeight: 0.6mm; HelpURL: \\cern.ch\dfs\Applications\Altium\Datasheets\R0805_NIC_NRC.pdf; Author: CERN DEM JLC; CreateDate: 03.12.2007; LatestRevisionDate: 13.03.2008
SW5-SW7 = SW_TYCO_1-1437575-4: as SW3 on sheet Main; Part Number: SW_TYCO_1-1437575-4; Component Kind: Standard; Component Type: Standard; Pin Count: 3; PackageDescription: Body 8.79 x 3.4mm, Slide Low Profile SPDT Switch, SSA Series; Family: Switch; Mounted: Yes; Socket: No; SMD: No; Sense: No; Status: None; ComponentHeight: 5.4mm; HelpURL: \\cern.ch\dfs\Applications\Altium\Datasheets\SW_TYCO_1-1437575-4.pdf; Author: CERN DEM JLC; CreateDate: 11.11.2013; LatestRevisionDate: 11.11.2013
T6 = DMMT5401: Name: DMMT5401; Manufacturer: Diodes
T7 = PMBT2369,215: NPN Transistor; Part Description: 15V 200mA NPN Switching Transistor; Manufacturer: NXP SEMICONDUCTORS; PressFit: No; Bonding: No; Part Number: PMBT2369,215; Component Kind: Standard; Component Type: Standard; Device: PMBT2369,215; PackageDescription: SOT23, 3 pin, Pitch 0.95mm - 1.3mm W X 2.9mm L X 1.1mm H, IPC Medium Density; Manufacturer Part Number: PMBT2369,215; Pin Count: 3; Case: SOT23-3; Mounted: Yes; Socket: No; SMD: Yes; Sense: No; ComponentHeight: 1.1mm; HelpURL: \\cern.ch\dfs\Applications\Altium\Datasheets\PMBT2369,215.pdf; Author: CERN DEM JLC; CreateDate: 01.07.2014; LatestRevisionDate: 01.07.2014
TP6 = VERO_20-2136: Part Description: Black Bead PCB Terminal Test Pin for 1.6mm PCB Thickness (1.32mm Hole); Manufacturer: VERO TECHNOLOGIES; PressFit: No; Part Number: VERO_20-2136; Component Kind: Standard; Component Type: Standard; Pin Count: 1; Family: Test Point; Mounted: Yes; Socket: No; SMD: No; Sense: No; Status: None; Manufacturer Part Number: 20-2136; ComponentHeight: 5.3mm; HelpURL: \\cern.ch\dfs\Applications\Altium\Datasheets\VERO_20-2136.pdf; Author: CERN DEM JLC; CreateDate: 21.07.2008; LatestRevisionDate: 15.07.2013
U4-U11 = SN74LV4T125: Name: SN74LV4T125; Manufacturer: TI

## Sheet HV_boost.SchDoc
size A4; DocumentNumber: 4; SheetNumber: 4; SheetTotal: 10
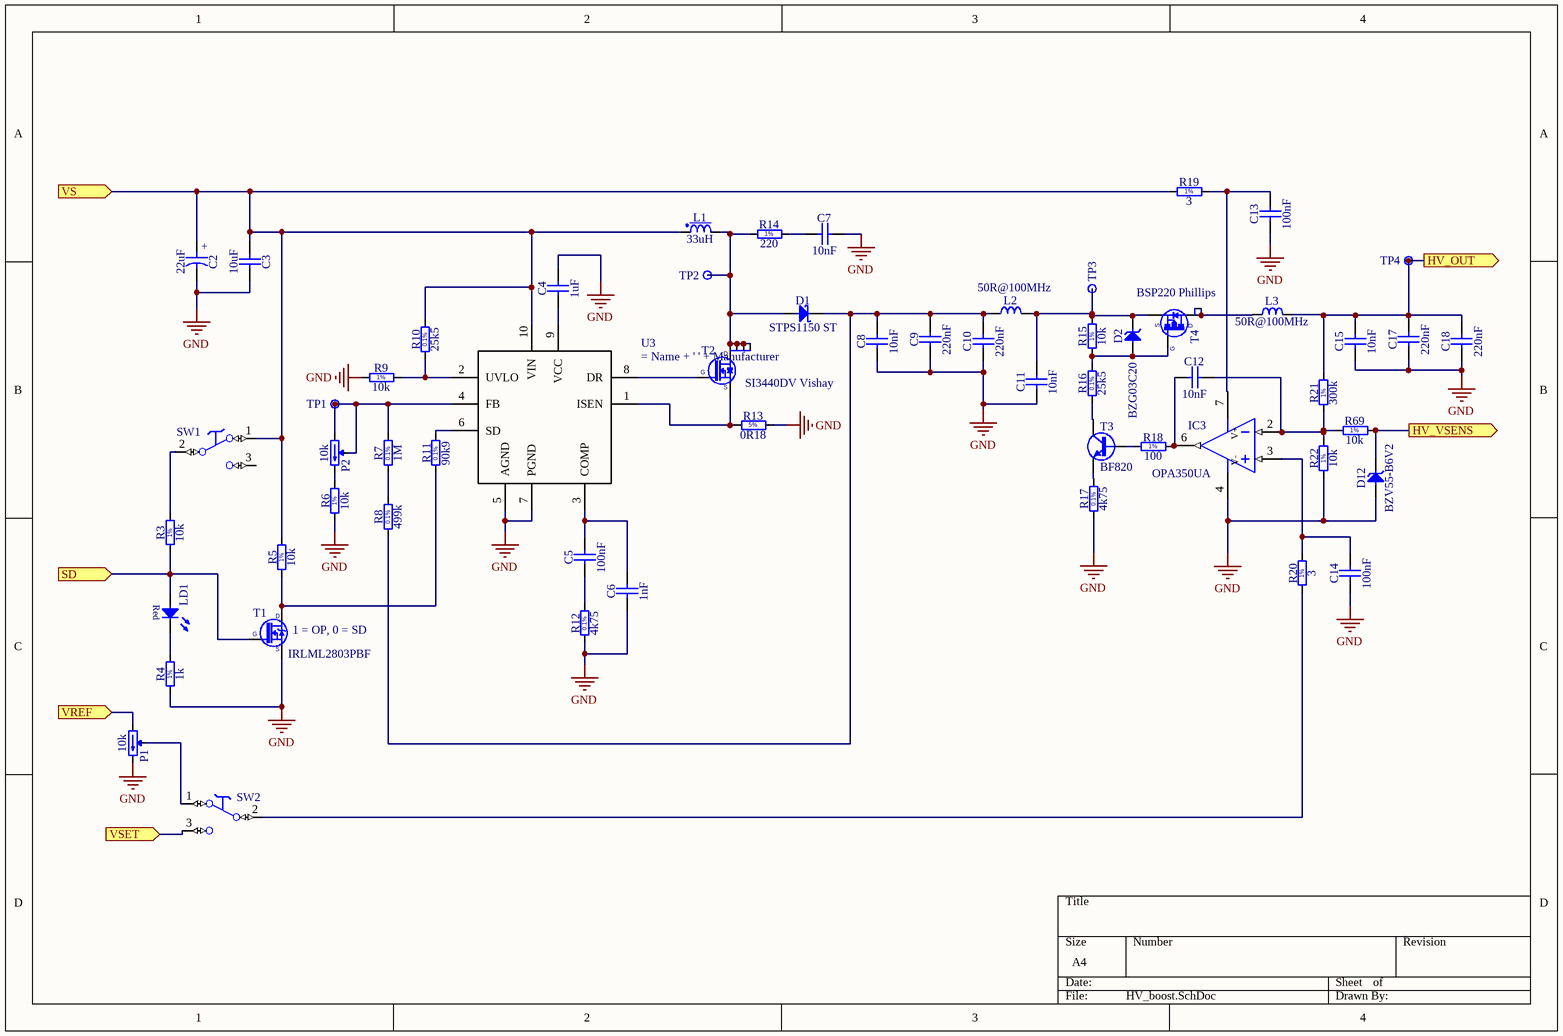
[diagram p2: HV_boost.SchDoc]

### Parts
C2  22uF  [CAPAE530X540N]
C3  10uF  [CAPC3216X180N]
C4  1uF  [CAPC2012X135N]
C5  100nF  [CAPC2012X135N]
C6  1nF  [CAPC2012X135N]
C7  10nF  [CAPC3216X100N]
C8  10nF  [CAPC3216X100N]
C9  220nF  [CAPR500-350X720X850]
C10  220nF  [CAPR500-350X720X850]
C11  10nF  [CAPC3216X100N]
C12  10nF  [CAPC2012X135N]
C13  100nF  [CAPC2012X135N]
C14  100nF  [CAPC2012X135N]
C15  10nF  [CAPC3216X100N]
C17  220nF  [CAPR500-350X720X850]
C18  220nF  [CAPR500-350X720X850]
D1  STPS1150 ST  [DIOM5027X244N]
D2  BZG03C20  [DIOM5326X230N]
D12  BZV55-B6V2  [DIOMELF3515N]
IC3  OPA350UA  [SOIC127P600X175-8N]
L1  33uH  [IND_PANASONIC_ELL6RH]
L2  50R@100MHz  [IND_MURATA_BLM31PG]
L3  50R@100MHz  [IND_MURATA_BLM31PG]
LD1  Super Red  [LED_OSRAM_LSR976]  (value not drawn)
P1  10k  [TRIM_BOURNS_3266W]
P2  10k  [TRIM_BOURNS_3266W]
R3  10k  [RESC2012X60N]
R4  1k  [RESC2012X60N]
R5  10k  [RESC2012X60N]
R6  10k  [RESC2012X60N]
R7  1M  [RESC2012X60N]
R8  499k  [RESC2012X60N]
R9  10k  [RESC2012X60N]
R10  25k5  [RESC2012X60N]
R11  90k9  [RESC2012X60N]
R12  4k75  [RESC2012X60N]
R13  0R18  [RESC2012X70N]
R14  220  [RESC3216X65N]
R15  10k  [RESC2012X60N]
R16  25k5  [RESC2012X60N]
R17  4k75  [RESC2012X60N]
R18  100  [RESC2012X60N]
R19  3  [RESC2012X60N]
R20  3  [RESC2012X60N]
R21  300k  [RESC2012X60N]
R22  10k  [RESC2012X60N]
R69  10k  [RESC2012X60N]
SW1  Switch  [SW_TYCO_1-1437575-4]  (value not drawn)
SW2  Switch  [SW_TYCO_1-1437575-4]  (value not drawn)
T1  IRLML2803PBF  [SOT95P237X112-3N]
T2  SI3440DV Vishay  [SOT95P280X110-6N]
T3  BF820  [SOT95P230X110-3N]
T4  BSP220 Phillips  [SOT230P700X175-4N]
TP1  Test Point  [VERO_20-2136]  (value not drawn)
TP2  Test Point  [VERO_20-2136]  (value not drawn)
TP3  Test Point  [VERO_20-2136]  (value not drawn)
TP4  Test Point  [VERO_20-2136]  (value not drawn)
U3  (no value)  [SOP50P490X110-10N]

### Ports
HV_OUT (out), HV_VSENS (out), SD (in), VREF (in), VS (in), VSET (in)

### Nets
GND: C2.2 C3.2 C4.2 C6.1 C7.2 C8.1 C9.1 C10.1 C11.1 C13.1 C14.1 C15.1 C17.1 C18.1 D12.2(A) IC3.4(V-) P1.3(CW) R4.1 R6.1 R9.1 R12.1 R13.2 R17.1 R22.1 T1.2(S) U3.5(AGND) U3.7(PGND)
OUTC: SW2.3(NO) ; port VSET
NetC2_1: C2.1 C3.1 L1.1 R5.2 R10.2 R19.1 SW1.1(NC) U3.10(VIN) ; port VS
NetC4_1: C4.1 U3.9(VCC)
NetC5_1: C5.1 R12.2
NetC5_2: C5.2 C6.2 U3.3(COMP)
NetC7_1: C7.1 R14.2
NetC8_2: C8.2 C9.2 C10.2 D1.1(C) L2.1 R8.1
NetC11_2: C11.2 D2.1(C) L2.2 R15.2 T4.3(S) TP3.1
NetC12_1: C12.1 IC3.6(OUT) R18.2
NetC12_2: C12.2 IC3.2(IN-) R21.1 R22.2 R69.1
NetC13_2: C13.2 IC3.7(V+) R19.2
NetC14_2: C14.2 IC3.3(IN+) R20.2
NetC15_2: C15.2 C17.2 C18.2 L3.2 R21.2 TP4.1 ; port HV_OUT
NetD1_2: D1.2(A) L1.2 R14.1 T2.1(D) T2.2(D) T2.5(D) T2.6(D) TP2.1
NetD2_2: D2.2(A) R15.1 R16.2 T4.1(G)
NetD12_1: D12.1(C) R69.2 ; port HV_VSENS
NetIC6_61: LD1.2(A) R3.1 T1.1(G) ; port SD
NetL3_1: L3.1 T4.2(D) T4.4(D)
NetL7_2: P1.1(CCW) ; port VREF
NetLD1_1: LD1.1(C) R4.2
NetP1_2: P1.2(W) SW2.1(NC)
NetP2_1: P2.1(CCW) P2.2(W) R7.2 TP1.1 U3.4(FB)
NetP2_3: P2.3(CW) R6.2
NetR3_2: R3.2 SW1.2(C)
NetR5_1: R5.1 R11.1 T1.3(D)
NetR7_1: R7.1 R8.2
NetR9_2: R9.2 R10.1 U3.2(UVLO)
NetR11_2: R11.2 U3.6(SD)
NetR13_1: R13.1 T2.4(S) U3.1(ISEN)
NetR16_1: R16.1 T3.3(C)
NetR17_2: R17.2 T3.2(E)
NetR18_1: R18.1 T3.1(B)
NetR20_1: R20.1 SW2.2(C)
NetT2_3: T2.3(G) U3.8(DR)

Not connected (* = marked no-connect by the designer): SW1 3(NO)

### Notes on the sheet
- (near T1) 1 = OP, 0 = SD
- (in symbol CAE530-540_22UF_16V_20%) +
- (in symbol LED_OSRAM_LSR976) Red
- (in symbol R0805_0R18_5%_0.25W_250PPM_PANASONIC_ERJ) 5%
- (in symbol R0805_1K_1%_0.33W_100PPM_VISHAY_CRCW-HP) 1%
- (in symbol R0805_1M_0.1%_0.1W_25PPM) 0.1%
- (in symbol R0805_3R_1%_0.125W_200PPM) 1%
- (in symbol R0805_4K75_0.1%_0.1W_10PPM) 0.1%
- (in symbol R0805_10K_1%_0.125W_100PPM) 1%
- (in symbol R0805_25K5_0.1%_0.1W_10PPM) 0.1%
- (in symbol R0805_90K9_0.1%_0.1W_10PPM) 0.1%
- (in symbol R0805_100R_1%_0.125W_100PPM) 1%
- (in symbol R0805_300K_1%_0.125W_100PPM) 1%
- (in symbol R0805_499K_0.1%_0.25W_25PPM_150V) 0.1%
- (in symbol R1206_220R_1%_0.25W_100PPM) 1%

### Library data of the parts
C2 = CAE530-540_22UF_16V_20%: Polarised capacitor; Part Description: Aluminum Electrolytic SMT Capacitor; Manufacturer: PANASONIC; Manufacturer Part Number: EEEFK1C220AR; Voltage: 16V; Tolerance: ±20%; Part Number: CAE530-540_22UF_16V_20%; Component Kind: Standard; Component Type: Standard; Pin Count: 2; Value: 22uF; Status: Not Recommended; Case: B; Mounted: Yes; Socket: No; SMD: Yes; Sense: No; ComponentHeight: 5.8mm; HelpURL: \\cern.ch\dfs\Applications\Altium\Datasheets\CAE_PANASONIC_FK.pdf; Author: CERN DEM JLC; CreateDate: 03.12.2007; LatestRevisionDate: 05.11.2014
C3 = CC1206_10UF_25V_10%_X7R: Non-polarised capacitor; Part Description: SMD Multilayer Chip Ceramic Capacitor; Manufacturer: GENERIC; Manufacturer1 Part Number: C1206C106K4RACTU; Voltage: 25V; TC: X7R; Tolerance: ±10%; Part Number: CC1206_10UF_25V_10%_X7R; Component Kind: Standard; Component Type: Standard; Pin Count: 2; Value: 10uF; Status: Preferred; Manufacturer Part Number: CC1206_10uF_25V_10%_X7R; Case: 1206; Mounted: Yes; Socket: No; SMD: Yes; Sense: No; Manufacturer1 Example: KEMET; Manufacturer1 ComponentHeight: 1.8mm; HelpURL: \\cern.ch\dfs\Applications\Altium\Datasheets\CC1206_X7R_KEMET.pdf; Author: CERN DEM JLC; CreateDate: 12.09.2012; LatestRevisionDate: 12.09.2012
C4 = CC0805_1UF_16V_10%_X7R: Non-polarised capacitor; Part Description: SMD Multilayer Chip Ceramic Capacitor; Manufacturer: GENERIC; Manufacturer1 Part Number: C2012X7R1C105K125AA; Voltage: 16V; TC: X7R; Tolerance: ±10%; Part Number: CC0805_1UF_16V_10%_X7R; Component Kind: Standard; Component Type: Standard; Pin Count: 2; Value: 1uF; Status: Preferred; Manufacturer Part Number: CC0805_1UF_16V_10%_X7R; Case: 0805; Mounted: Yes; Socket: No; SMD: Yes; Sense: No; Manufacturer1 Example: TDK; Manufacturer1 ComponentHeight: 1.45mm; HelpURL: \\cern.ch\dfs\Applications\Altium\Datasheets\CC0805_X7R_TDK_C.pdf; Author: CERN DEM JLC; CreateDate: 03.12.2007; LatestRevisionDate: 22.04.2015
C5 C13 C14 = CC0805_100NF_50V_10%_X7R: as C35 on sheet Pulser; Part Number: CC0805_100NF_50V_10%_X7R; Component Kind: Standard; Component Type: Standard; Pin Count: 2; Value: 100nF; Status: Preferred; Manufacturer Part Number: CC0805_100NF_50V_10%_X7R; Case: 0805; Mounted: Yes; Socket: No; SMD: Yes; Sense: No; Manufacturer1 Example: TDK; Manufacturer1 ComponentHeight: 1mm; HelpURL: \\cern.ch\dfs\Applications\Altium\Datasheets\CC0805_X7R_TDK_C.pdf; Author: CERN DEM JLC; CreateDate: 03.12.2007; LatestRevisionDate: 22.04.2015
C6 = CC0805_1NF_50V_10%_X7R: Non-polarised capacitor; Part Description: SMD Multilayer Chip Ceramic Capacitor; Manufacturer: GENERIC; Manufacturer1 Part Number: 223858015623; Voltage: 50V; TC: X7R; Tolerance: ±10%; Part Number: CC0805_1NF_50V_10%_X7R; Component Kind: Standard; Component Type: Standard; Pin Count: 2; Value: 1nF; Status: Preferred; Manufacturer Part Number: CC0805_1NF_50V_10%_X7R; Case: 0805; Mounted: Yes; Socket: No; SMD: Yes; Sense: No; Manufacturer1 Example: PHYCOMP; Manufacturer1 ComponentHeight: 1.35mm; HelpURL: \\cern.ch\dfs\Applications\Altium\Datasheets\CC0805_X7R_PHYCOMP.pdf; Author: CERN DEM JLC; CreateDate: 03.12.2007; LatestRevisionDate: 22.04.2015
C7 C8 C11 C15 = CC1206_10NF_200V_5%_C0G: Non-polarised capacitor; Part Description: SMD Multilayer Chip Ceramic Capacitor; Manufacturer: GENERIC; Manufacturer1 Part Number: C1206C103J2GACAUTO; Voltage: 200V; TC: C0G/NP0; Tolerance: ±5%; Part Number: CC1206_10NF_200V_5%_C0G; Component Kind: Standard; Component Type: Standard; Pin Count: 2; Value: 10nF; Status: Preferred; Manufacturer Part Number: CC1206_10NF_200V_5%_C0G; Case: 1206; Mounted: Yes; Socket: No; SMD: Yes; Sense: No; Manufacturer1 Example: KEMET; Manufacturer1 ComponentHeight: 1.0mm; HelpURL: \\cern.ch\dfs\Applications\Altium\Datasheets\CC1206_C0G_KEMET.pdf; Author: CERN DEM JLC; CreateDate: 25.11.2014; LatestRevisionDate: 25.11.2014
C9 C10 C17 C18 = CPER_220NF_100V_10%_500-350X720X850: Non-polarised capacitor; Part Description: Metallized Polyester Film Capacitor (MKS2); Manufacturer: WIMA; Manufacturer Part Number: MKS2D032201C00KSSD; Voltage: 100VDC/63VAC; Tolerance: ±10%; Part Number: CPER_220NF_100V_10%_500-350X720X850; Component Kind: Standard; Component Type: Standard; Pin Count: 2; Value: 220nF; Status: None; Case: LS5 W3.5 x L7.2 x H8.5; Mounted: Yes; Socket: No; SMD: No; Sense: No; ComponentHeight: 8.5mm; HelpURL: \\cern.ch\dfs\Applications\Altium\Datasheets\CPER_WIMA_MKS2.pdf; Author: CERN DEM JLC; CreateDate: 22.03.2010; LatestRevisionDate: 30.01.2012
C12 = CC0805_10NF_50V_5%_X7R: as C58 on sheet Pulser; Part Number: CC0805_10NF_50V_5%_X7R; Component Kind: Standard; Component Type: Standard; Pin Count: 2; Value: 10nF; Status: None; Manufacturer Part Number: CC0805_10NF_50V_5%_X7R; Case: 0805; Mounted: Yes; Socket: No; SMD: Yes; Sense: No; Manufacturer1 Example: AVX; Manufacturer1 ComponentHeight: 0.94mm; HelpURL: \\cern.ch\dfs\Applications\Altium\Datasheets\CC0805_X7R_AVX.pdf; Author: CERN DEM JLC; CreateDate: 18.01.2011; LatestRevisionDate: 18.01.2011
D1 = STPS1150: Diode Schottky  Anode Pin 1 Cathode Pin 3 (Pas de pin 2); Name: STPS1150; Manufacturer: ST
D2 = BZG03C20: Zener Diode; Part Description: Voltage Regulator Diode; Manufacturer: VISHAY SEMICONDUCTOR; Voltage: 20V; Power: 1.25W; PressFit: No; Bonding: No; Part Number: BZG03C20; Component Kind: Standard; Component Type: Standard; Device: BZG03C20; PackageDescription: DO-214-AC/SMA Molded Diode, Body 5.3x2.6mm, IPC Medium Density; Manufacturer Part Number: BZG03C20; Pin Count: 2; Case: DO-214AC; Mounted: Yes; Socket: No; SMD: Yes; Sense: No; ComponentHeight: 2.3mm; HelpURL: \\cern.ch\dfs\Applications\Altium\Datasheets\BZG03C.pdf; Author: CERN DEM JLC; CreateDate: 02.06.2008; LatestRevisionDate: 02.06.2008
D12 = BZV55-B6V2: Zener Diode; Part Description: Voltage Regulator Diode; Manufacturer: NXP SEMICONDUCTORS; Voltage: 6V2; Power: 500mW; PressFit: No; Bonding: No; Part Number: BZV55-B6V2; Component Kind: Standard; Component Type: Standard; Device: BZV55-B6V2; PackageDescription: SOD80C, MELF Diode, 2-Leads, Body 3.5x1.5mm, IPC Medium Density; Manufacturer Part Number: BZV55-B6V2; Pin Count: 2; Case: SOD-80C; Mounted: Yes; Socket: No; SMD: Yes; Sense: No; ComponentHeight: 1.6mm; HelpURL: \\cern.ch\dfs\Applications\Altium\Datasheets\BZV55.pdf; Author: CERN DEM JLC; CreateDate: 06.05.2008; LatestRevisionDate: 06.05.2008
IC3 = OPA350UA: Operational Amplifier; Part Description: High-Speed, Single-Supply, Rail-to-Rail Operational Amplifier; Manufacturer: TEXAS INSTRUMENTS; PressFit: No; Bonding: No; Part Number: OPA350UA; Component Kind: Standard; Component Type: Standard; Device: OPA350UA; PackageDescription: SOIC 8, Pitch 1.27mm - Body 4x5mm, IPC Medium Density; Manufacturer Part Number: OPA350UA; Pin Count: 5; Case: SOIC8; Mounted: Yes; Socket: No; SMD: Yes; Sense: No; ComponentHeight: 1.75mm; Author: CERN DEM JLC; HelpURL: \\cern.ch\dfs\Applications\Altium\Datasheets\OPA350UA.pdf; CreateDate: 11.10.2012; LatestRevisionDate: 11.10.2012
L1 = IND_33UH_20%_PANASONIC_ELL6RH330M: Inductor With Magnetic core 1Dot; Part Description: SMD Choke Coil; Power: 600mA; Resistance: 0.38R; Tolerance: ±20%; Part Number: IND_33UH_20%_PANASONIC_ELL6RH330M; Component Kind: Standard; Component Type: Standard; Pin Count: 2; Value: 33uH; Status: None; Manufacturer: PANASONIC; Manufacturer Part Number: ELL6RH330M; Mounted: Yes; Socket: No; SMD: Yes; Sense: No; ComponentHeight: 2.8mm; HelpURL: \\cern.ch\dfs\Applications\Altium\Datasheets\IND_PANASONIC_ELL6RH.pdf; Author: CERN DEM JMW; CreateDate: 09.01.2009; LatestRevisionDate: 09.01.2009
L2 L3 = IND1206_MURATA_BLM31PG500SN1: Inductor; Part Description: SMD EMIFIL Chip Ferrite Bead; Manufacturer: MURATA; Power: 3.5A; Resistance: 0.015R; Part Number: IND1206_MURATA_BLM31PG500SN1; Component Kind: Standard; Component Type: Standard; Pin Count: 2; Value: 50R@100MHz; Status: None; Manufacturer Part Number: BLM31PG500SN1; Case: 1206; Mounted: Yes; Socket: No; SMD: Yes; Sense: No; ComponentHeight: 1.3mm; HelpURL: \\cern.ch\dfs\Applications\Altium\Datasheets\IND1206_MURATA_BLM31P.pdf; Author: CERN DEM JLC; CreateDate: 05.12.2013; LatestRevisionDate: 05.12.2013
LD1 = LED_OSRAM_LSR976: as LD2 on sheet Pulser; Part Number: LED_OSRAM_LSR976; Component Kind: Standard; Component Type: Standard; Color: Super Red; PackageDescription: Super Red Chip LED, 2-Leads, Body 2 x1.25mm, IPC Medium Density; Pin Count: 2; Case: 0805; Mounted: Yes; Socket: No; SMD: Yes; Sense: No; ComponentHeight: 0.9mm; HelpURL: \\cern.ch\dfs\Applications\Altium\Datasheets\LED_OSRAM_LSR976.pdf; Author: CERN DEM JLC; CreateDate: 18.05.2010; LatestRevisionDate: 18.05.2010
P1 P2 = TRIM_12T_10K_BOURNS_3266W-1-103LF: as P3 on sheet Main; Part Number: TRIM_12T_10K_BOURNS_3266W-1-103LF; Component Kind: Standard; Component Type: Standard; Pin Count: 3; Value: 10k; Manufacturer Part Number: 3266W-1-103LF; Case: 3266W; Mounted: Yes; Socket: No; SMD: No; Sense: No; ComponentHeight: 7.75mm; HelpURL: \\cern.ch\dfs\Applications\Altium\Datasheets\TRIM_BOURNS_3266W.pdf; Author: CERN DEM JLC; CreateDate: 10.06.2008; LatestRevisionDate: 28.11.2012
R3 R5 R6 R9 R15 R22 R69 = R0805_10K_1%_0.125W_100PPM: as R33 on sheet Pulser; Part Number: R0805_10K_1%_0.125W_100PPM; Component Kind: Standard; Component Type: Standard; Pin Count: 2; Value: 10k; Status: Preferred; Tolerance: ±1%; Manufacturer Part Number: R0805_10K_1%_0.125W_100PPM; Case: 0805; Mounted: Yes; Sense: No; Socket: No; SMD: Yes; Manufacturer1 Example: NIC COMPONENT; Manufacturer1 ComponentHeight: 0.6mm; HelpURL: \\cern.ch\dfs\Applications\Altium\Datasheets\R0805_NIC_NRC.pdf; Author: CERN DEM JLC; CreateDate: 03.12.2007; LatestRevisionDate: 13.03.2008
R4 = R0805_1K_1%_0.33W_100PPM_VISHAY_CRCW-HP: as R31 on sheet Pulser; Part Number: R0805_1K_1%_0.33W_100PPM_VISHAY_CRCW-HP; Component Kind: Standard; Component Type: Standard; Pin Count: 2; Value: 1k; Status: None; Tolerance: ±1%; Case: 0805; Mounted: Yes; Sense: No; Socket: No; SMD: Yes; Manufacturer1 ComponentHeight: 0.6mm; HelpURL: \\cern.ch\dfs\Applications\Altium\Datasheets\R0805_VISHAY_CRCW-HP e3.pdf; Author: CERN DEM JLC; CreateDate: 16.06.2010; LatestRevisionDate: 16.06.2010
R7 = R0805_1M_0.1%_0.1W_25PPM: Resistor - 0.1%; Part Description: Precision Surface Mount Resistor; Manufacturer: GENERIC; Manufacturer1 Part Number: PCF0805R-1M0BT1; Power: 0.1W; TC: ±25ppm/°C; PressFit: No; Part Number: R0805_1M_0.1%_0.1W_25PPM; Component Kind: Standard; Component Type: Standard; Pin Count: 2; Value: 1M; Status: Not Recommended; Tolerance: ±0.1%; Manufacturer Part Number: R0805_1M_0.1%_0.1W_25PPM; Case: 0805; Mounted: Yes; Sense: No; Socket: No; SMD: Yes; Manufacturer1 Example: WELWYN COMPONENTS; HelpURL: \\cern.ch\dfs\Applications\Altium\Datasheets\R0805_WELWYN_PCF0805R.pdf; Author: CERN DEM JLC; CreateDate: 17.11.2008; LatestRevisionDate: 26.04.2010
R8 = R0805_499K_0.1%_0.25W_25PPM_150V: Resistor - 0.1%; Part Description: Thin Film Chip Resistor; Manufacturer: GENERIC; Manufacturer1 Part Number: RP73PF2A499KBTDF; Power: 0.25W; TC: ±25ppm/°C; Voltage: 150V; PressFit: No; Part Number: R0805_499K_0.1%_0.25W_25PPM_150V; Component Kind: Standard; Component Type: Standard; Pin Count: 2; Value: 499k; Status: None; Tolerance: ±0.1%; Manufacturer Part Number: R0805_499K_0.1%_0.25W_25PPM_150V; Case: 0805; Mounted: Yes; Sense: No; Socket: No; SMD: Yes; Manufacturer1 Example: TYCO ELECTRONICS; Manufacturer1 ComponentHeight: 0.65mm; HelpURL: \\cern.ch\dfs\Applications\Altium\Datasheets\R0805_TYCO_RP73.pdf; Author: CERN DEM BC; CreateDate: 04.12.2015; LatestRevisionDate: 04.12.2015
R10 R16 = R0805_25K5_0.1%_0.1W_10PPM: Resistor - 0.1%; Part Description: Thin Film Chip Resistor; Manufacturer: GENERIC; Manufacturer1 Part Number: RN73C2A25K5BTG; Power: 0.1W; TC: ±10ppm; PressFit: No; Part Number: R0805_25K5_0.1%_0.1W_10PPM; Component Kind: Standard; Component Type: Standard; Pin Count: 2; Value: 25k5; Status: Not Recommended; Tolerance: ±0.1%; Manufacturer Part Number: R0805_25K5_0.1%_0.1W_10PPM; Case: 0805; Mounted: Yes; Sense: No; Socket: No; SMD: Yes; Manufacturer1 Example: TYCO HOLSWORTHY; Manufacturer1 ComponentHeight: 0.6mm; HelpURL: \\cern.ch\dfs\Applications\Altium\Datasheets\R0805_Tyco_RN73.pdf; Author: CERN DEM JLC; CreateDate: 03.12.2007; LatestRevisionDate: 13.03.2008
R11 = R0805_90K9_0.1%_0.1W_10PPM: Resistor - 0.1%; Part Description: Thin Film Chip Resistor; Manufacturer: GENERIC; Manufacturer1 Part Number: RN73C2A90K9BTG; Power: 0.1W; TC: ±10ppm; PressFit: No; Part Number: R0805_90K9_0.1%_0.1W_10PPM; Component Kind: Standard; Component Type: Standard; Pin Count: 2; Value: 90k9; Status: Not Recommended; Tolerance: ±0.1%; Manufacturer Part Number: R0805_90K9_0.1%_0.1W_10PPM; Case: 0805; Mounted: Yes; Sense: No; Socket: No; SMD: Yes; Manufacturer1 Example: TYCO HOLSWORTHY; Manufacturer1 ComponentHeight: 0.6mm; HelpURL: \\cern.ch\dfs\Applications\Altium\Datasheets\R0805_Tyco_RN73.pdf; Author: CERN DEM JLC; CreateDate: 03.12.2007; LatestRevisionDate: 13.03.2008
R12 R17 = R0805_4K75_0.1%_0.1W_10PPM: Resistor - 0.1%; Part Description: Thin Film Chip Resistor; Manufacturer: GENERIC; Manufacturer1 Part Number: RN73C2A4K75BTG; Power: 0.1W; TC: ±10ppm; PressFit: No; Part Number: R0805_4K75_0.1%_0.1W_10PPM; Component Kind: Standard; Component Type: Standard; Pin Count: 2; Value: 4k75; Status: Not Recommended; Tolerance: ±0.1%; Manufacturer Part Number: R0805_4K75_0.1%_0.1W_10PPM; Case: 0805; Mounted: Yes; Sense: No; Socket: No; SMD: Yes; Manufacturer1 Example: TYCO HOLSWORTHY; Manufacturer1 ComponentHeight: 0.6mm; HelpURL: \\cern.ch\dfs\Applications\Altium\Datasheets\R0805_Tyco_RN73.pdf; Author: CERN DEM JLC; CreateDate: 03.12.2007; LatestRevisionDate: 13.03.2008
R13 = R0805_0R18_5%_0.25W_250PPM_PANASONIC_ERJ: Resistor - 5%; Part Description: Low Resistance Thick Film Chip Resistor; Manufacturer Part Number: ERJ6BSJR18V; Power: 0.25W; TC: ±250ppm/°C; PressFit: No; Part Number: R0805_0R18_5%_0.25W_250PPM_PANASONIC_ERJ; Component Kind: Standard; Component Type: Standard; Pin Count: 2; Value: 0R18; Status: Not Recommended; Tolerance: ±5%; Manufacturer: PANASONIC; Case: 0805; Mounted: Yes; Sense: No; Socket: No; SMD: Yes; ComponentHeight: 0.7mm; HelpURL: \\cern.ch\dfs\Applications\Altium\Datasheets\R0805_PANASONIC_ERJ.pdf; Author: CERN DEM JLC; CreateDate: 22.06.2011; LatestRevisionDate: 22.06.2011
R14 = R1206_220R_1%_0.25W_100PPM: Resistor - 1%; Part Description: General Purpose Thick Film Chip Resistor; Manufacturer: GENERIC; Manufacturer1 Part Number: NRC12F2200TRF; Power: 0.25W; TC: ±100ppm/°C; PressFit: No; Part Number: R1206_220R_1%_0.25W_100PPM; Component Kind: Standard; Component Type: Standard; Pin Count: 2; Value: 220; Status: Preferred; Tolerance: ±1%; Manufacturer Part Number: R1206_220R_1%_0.25W_100PPM; Case: 1206; Mounted: Yes; Sense: No; Socket: No; SMD: Yes; Manufacturer1 Example: NIC COMPONENT; Manufacturer1 ComponentHeight: 0.65mm; HelpURL: \\cern.ch\dfs\Applications\Altium\Datasheets\R1206_NIC_NRC.pdf; Author: CERN DEM JLC; CreateDate: 03.12.2007; LatestRevisionDate: 13.03.2008
R18 = R0805_100R_1%_0.125W_100PPM: Resistor - 1%; Part Description: General Purpose Thick Film Chip Resistor; Manufacturer: GENERIC; Manufacturer1 Part Number: NRC10F4700TRF; Power: 0.125W; TC: ±100ppm/°C; PressFit: No; Part Number: R0805_100R_1%_0.125W_100PPM; Component Kind: Standard; Component Type: Standard; Pin Count: 2; Value: 100; Status: Preferred; Tolerance: ±1%; Manufacturer Part Number: R0805_100R_1%_0.125W_100PPM; Case: 0805; Mounted: Yes; Sense: No; Socket: No; SMD: Yes; Manufacturer1 Example: NIC COMPONENT; Manufacturer1 ComponentHeight: 0.6mm; HelpURL: \\cern.ch\dfs\Applications\Altium\Datasheets\R0805_NIC_NRC.pdf; Author: CERN DEM JLC; CreateDate: 03.12.2007; LatestRevisionDate: 13.03.2008
R19 R20 = R0805_3R_1%_0.125W_200PPM: Resistor - 1%; Part Description: General Purpose Thick Film Chip Resistor; Manufacturer: GENERIC; Manufacturer1 Part Number: 232273463008L or RC0805FR-073RL; Power: 0.125W; TC: ±200ppm/°C; PressFit: No; Part Number: R0805_3R_1%_0.125W_200PPM; Component Kind: Standard; Component Type: Standard; Pin Count: 2; Value: 3; Status: Preferred; Tolerance: ±1%; Manufacturer Part Number: R0805_3R_1%_0.125W_200PPM; Case: 0805; Mounted: Yes; Sense: No; Socket: No; SMD: Yes; Manufacturer1 Example: YAGEO PHYCOMP; Manufacturer1 ComponentHeight: 0.65mm; HelpURL: \\cern.ch\dfs\Applications\Altium\Datasheets\R0805_Phycomp_RC0805.pdf; Author: CERN DEM JLC; CreateDate: 03.12.2007; LatestRevisionDate: 17.10.2012
R21 = R0805_300K_1%_0.125W_100PPM: as R34 on sheet Pulser; Part Number: R0805_300K_1%_0.125W_100PPM; Component Kind: Standard; Component Type: Standard; Pin Count: 2; Value: 300k; Status: Preferred; Tolerance: ±1%; Manufacturer Part Number: R0805_300K_1%_0.125W_100PPM; Case: 0805; Mounted: Yes; Sense: No; Socket: No; SMD: Yes; Manufacturer1 Example: NIC COMPONENT; Manufacturer1 ComponentHeight: 0.6mm; HelpURL: \\cern.ch\dfs\Applications\Altium\Datasheets\R0805_NIC_NRC.pdf; Author: CERN DEM JLC; CreateDate: 03.12.2007; LatestRevisionDate: 13.03.2008
SW1 SW2 = SW_TYCO_1-1437575-4: as SW3 on sheet Main; Part Number: SW_TYCO_1-1437575-4; Component Kind: Standard; Component Type: Standard; Pin Count: 3; PackageDescription: Body 8.79 x 3.4mm, Slide Low Profile SPDT Switch, SSA Series; Family: Switch; Mounted: Yes; Socket: No; SMD: No; Sense: No; Status: None; ComponentHeight: 5.4mm; HelpURL: \\cern.ch\dfs\Applications\Altium\Datasheets\SW_TYCO_1-1437575-4.pdf; Author: CERN DEM JLC; CreateDate: 11.11.2013; LatestRevisionDate: 11.11.2013
T1 = IRLML2803PBF: N-CHANNEL MOSFET WITH ZENER DIODE; Part Description: 30V 1.2A  N-Channel HEXFET® Power MOSFET; Manufacturer: INTERNATIONAL RECTIFIER; PressFit: No; Bonding: No; Part Number: IRLML2803PBF; Component Kind: Standard; Component Type: Standard; Device: IRLML2803PBF; PackageDescription: SOT, 0.95mm, pitch; 3 pin,1.30mm W X 2.92mm L X 1.12mm H body, IPC Medium Density; Manufacturer Part Number: IRLML2803PBF; Pin Count: 3; Case: SOT23-3; Mounted: Yes; Socket: No; SMD: Yes; Sense: No; ComponentHeight: 1.12mm; HelpURL: \\cern.ch\dfs\Applications\Altium\Datasheets\IRLML2803PBF.pdf; Author: CERN DEM JMW; CreateDate: 08.12.2010; LatestRevisionDate: 08.12.2010
T2 = SI3440DV: N-Channel MOSFET; Name: SI3440DV; Manufacturer: Vishay
T3 = BF820: NPN Transistor; Part Description: 300V 50mA NPN High-Voltage Transistor; Manufacturer: NXP SEMICONDUCTORS; PressFit: No; Bonding: No; Part Number: BF820; Component Kind: Standard; Component Type: Standard; Device: BF820; PackageDescription: SOT23, 3 pin, Pitch 0.95mm - 1.3mm W X 2.9mm L X 1.1mm H, IPC Medium Density; Manufacturer Part Number: BF820; Pin Count: 3; Case: SOT23-3; Mounted: Yes; Socket: No; SMD: Yes; Sense: No; ComponentHeight: 1.1mm; HelpURL: \\cern.ch\dfs\Applications\Altium\Datasheets\BF820.pdf; Author: CERN DEM JLC; CreateDate: 23.09.2014; LatestRevisionDate: 23.09.2014
T4 = BSP220: P-Channel MOSFET; Name: BSP220; Manufacturer: Phillips
TP1-TP4 = VERO_20-2136: as TP6 on sheet Pulser; Part Number: VERO_20-2136; Component Kind: Standard; Component Type: Standard; Pin Count: 1; Family: Test Point; Mounted: Yes; Socket: No; SMD: No; Sense: No; Status: None; Manufacturer Part Number: 20-2136; ComponentHeight: 5.3mm; HelpURL: \\cern.ch\dfs\Applications\Altium\Datasheets\VERO_20-2136.pdf; Author: CERN DEM JLC; CreateDate: 21.07.2008; LatestRevisionDate: 15.07.2013
U3 = LM3481: Manufacutrer: TI; Name: LM3481